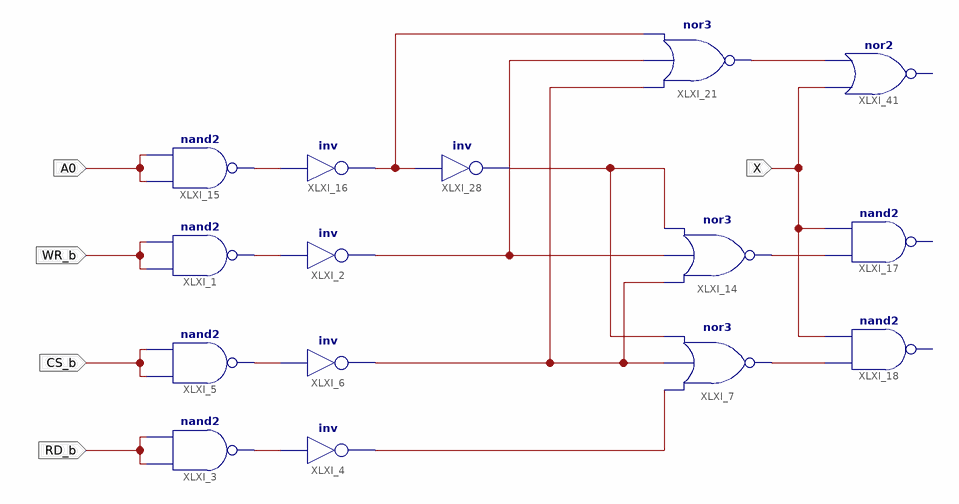
[diagram p0: schematic sheet 1]
// Xilinx ISE schematic ym_io.sch (spartan3a) as structural Verilog: 15 symbols, 5 ports
module ym_io (
  input  WR_b,
  input  CS_b,
  input  RD_b,
  input  A0,
  input  X
);

  wire XLXN_1, XLXN_3, XLXN_6, XLXN_19, XLXN_25, XLXN_28, XLXN_29, XLXN_37, XLXN_71, XLXN_75, XLXN_77,
       XLXN_78;

  nand XLXI_1 (XLXN_1, WR_b, WR_b);
  not XLXI_2 (XLXN_75, XLXN_1);
  nand XLXI_5 (XLXN_6, CS_b, CS_b);
  not XLXI_6 (XLXN_78, XLXN_6);
  nand XLXI_3 (XLXN_3, RD_b, RD_b);
  not XLXI_4 (XLXN_19, XLXN_3);
  nand XLXI_15 (XLXN_25, A0, A0);
  not XLXI_16 (XLXN_77, XLXN_25);
  not XLXI_28 (XLXN_71, XLXN_77);
  nor XLXI_21 (XLXN_37, XLXN_78, XLXN_75, XLXN_77);
  // nand2 XLXI_18 has open pins: I0=XLXN_28, I1=X, O=open
  // nand2 XLXI_17 has open pins: I0=XLXN_29, I1=X, O=open
  nor XLXI_14 (XLXN_29, XLXN_78, XLXN_75, XLXN_71);
  nor XLXI_7 (XLXN_28, XLXN_19, XLXN_78, XLXN_71);
  // nor2 XLXI_41 has open pins: I0=X, I1=XLXN_37, O=open
endmodule
